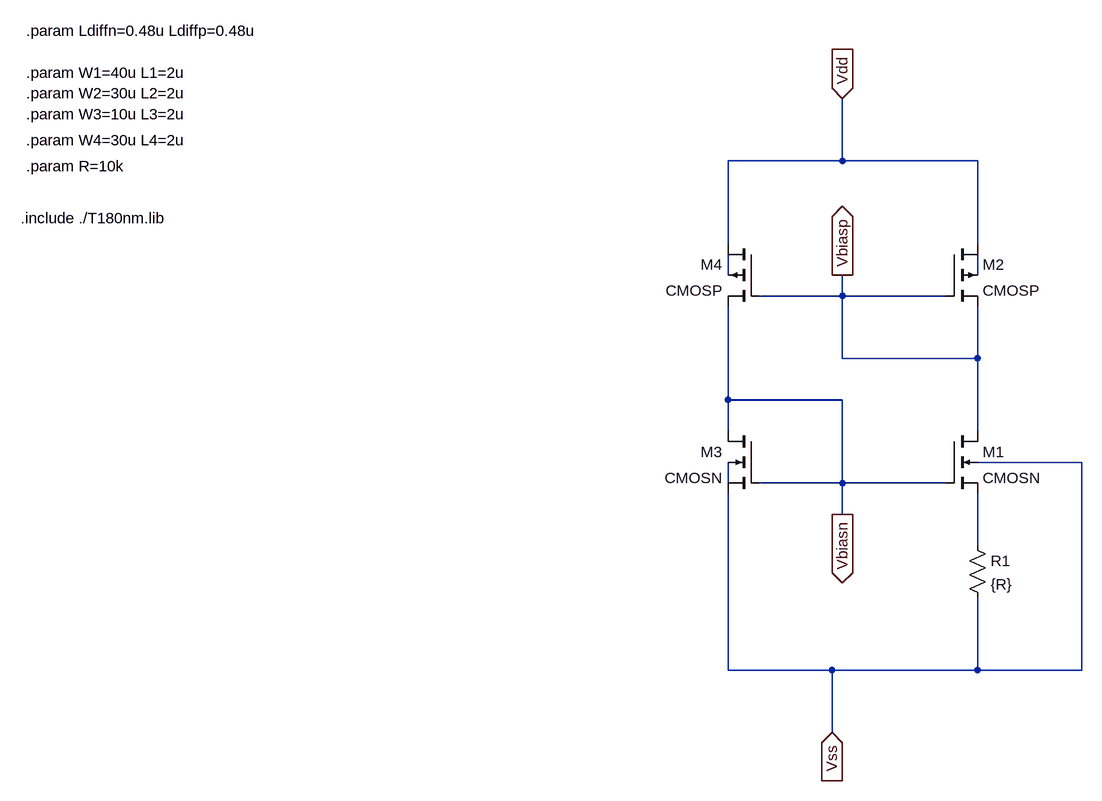
[diagram p0: schematic bias.asc]
bias.asc, the LTspice schematic file:
Version 4
SHEET 1 880 760
WIRE 16 -224 16 -320
WIRE 16 -224 -160 -224
WIRE 224 -224 16 -224
WIRE -160 -96 -160 -224
WIRE 224 -96 224 -224
WIRE -160 -48 -160 -80
WIRE 224 -48 224 -80
WIRE 16 -16 16 -48
WIRE 16 -16 -112 -16
WIRE 176 -16 16 -16
WIRE 16 80 16 -16
WIRE 224 80 224 0
WIRE 224 80 16 80
WIRE -160 144 -160 0
WIRE 16 144 -160 144
WIRE -160 192 -160 144
WIRE 224 192 224 80
WIRE 384 240 224 240
WIRE -160 272 -160 240
WIRE 16 272 16 144
WIRE 16 272 -112 272
WIRE 176 272 16 272
WIRE 16 320 16 272
WIRE 224 368 224 288
WIRE -160 560 -160 288
WIRE 0 560 -160 560
WIRE 224 560 224 448
WIRE 224 560 0 560
WIRE 384 560 384 240
WIRE 384 560 224 560
WIRE 0 656 0 560
FLAG 16 -320 Vdd
IOPIN 16 -320 In
FLAG 0 656 Vss
IOPIN 0 656 In
FLAG 16 320 Vbiasn
IOPIN 16 320 Out
FLAG 16 -48 Vbiasp
IOPIN 16 -48 Out
SYMBOL nmos4 176 192 R0
SYMATTR InstName M1
SYMATTR Value CMOSN
SYMATTR Value2 l={L1} w={W1} ad={Ldiffn*W1} as={Ldiffn*W1} pd={2*Ldiffn+W1} ps={2*Ldiffn+W1}
SYMBOL pmos4 176 -96 R0
SYMATTR InstName M2
SYMATTR Value CMOSP
SYMATTR Value2 l={L2} w={W2} ad={Ldiffp*W2} as={Ldiffp*W2} pd={2*Ldiffp+W2} ps={2*Ldiffp+W2}
SYMBOL nmos4 -112 192 M0
SYMATTR InstName M3
SYMATTR Value CMOSN
SYMATTR Value2 l={L3} w={W3} ad={Ldiffn*W3} as={Ldiffn*W3} pd={2*Ldiffn+W3} ps={2*Ldiffn+W3}
SYMBOL pmos4 -112 -96 M0
SYMATTR InstName M4
SYMATTR Value CMOSP
SYMATTR Value2 l={L4} w={W4} ad={Ldiffp*W4} as={Ldiffp*W4} pd={2*Ldiffp+W4} ps={2*Ldiffp+W4}
SYMBOL res 208 352 R0
SYMATTR InstName R1
SYMATTR Value {R}
TEXT -1248 -136 Left 2 !.include ./T180nm.lib
TEXT -1240 -424 Left 2 !.param Ldiffn=0.48u Ldiffp=0.48u
TEXT -1240 -360 Left 2 !.param W1=40u L1=2u
TEXT -1240 -328 Left 2 !.param W2=30u L2=2u
TEXT -1240 -296 Left 2 !.param W3=10u L3=2u
TEXT -1240 -256 Left 2 !.param W4=30u L4=2u
TEXT -1240 -216 Left 2 !.param R=10k

The netlist it stands for:
* bias.asc
M1 Vbiasp Vbiasn N004 Vss CMOSN l={L1} w={W1} ad={Ldiffn*W1} as={Ldiffn*W1} pd={2*Ldiffn+W1} ps={2*Ldiffn+W1}
M2 Vdd Vbiasp Vbiasp N002 CMOSP l={L2} w={W2} ad={Ldiffp*W2} as={Ldiffp*W2} pd={2*Ldiffp+W2} ps={2*Ldiffp+W2}
M3 Vbiasn Vbiasn Vss N003 CMOSN l={L3} w={W3} ad={Ldiffn*W3} as={Ldiffn*W3} pd={2*Ldiffn+W3} ps={2*Ldiffn+W3}
M4 Vdd Vbiasp Vbiasn N001 CMOSP l={L4} w={W4} ad={Ldiffp*W4} as={Ldiffp*W4} pd={2*Ldiffp+W4} ps={2*Ldiffp+W4}
R1 N004 Vss {R}
.model NMOS NMOS
.model PMOS PMOS
.lib standard.mos
.include ./T180nm.lib
.param Ldiffn=0.48u Ldiffp=0.48u
.param W1=40u L1=2u
.param W2=30u L2=2u
.param W3=10u L3=2u
.param W4=30u L4=2u
.param R=10k
.backanno
.end